# EAGLE design AVRI2CIO_V0_3_LEVEL1 (EAGLE 6.6.0)
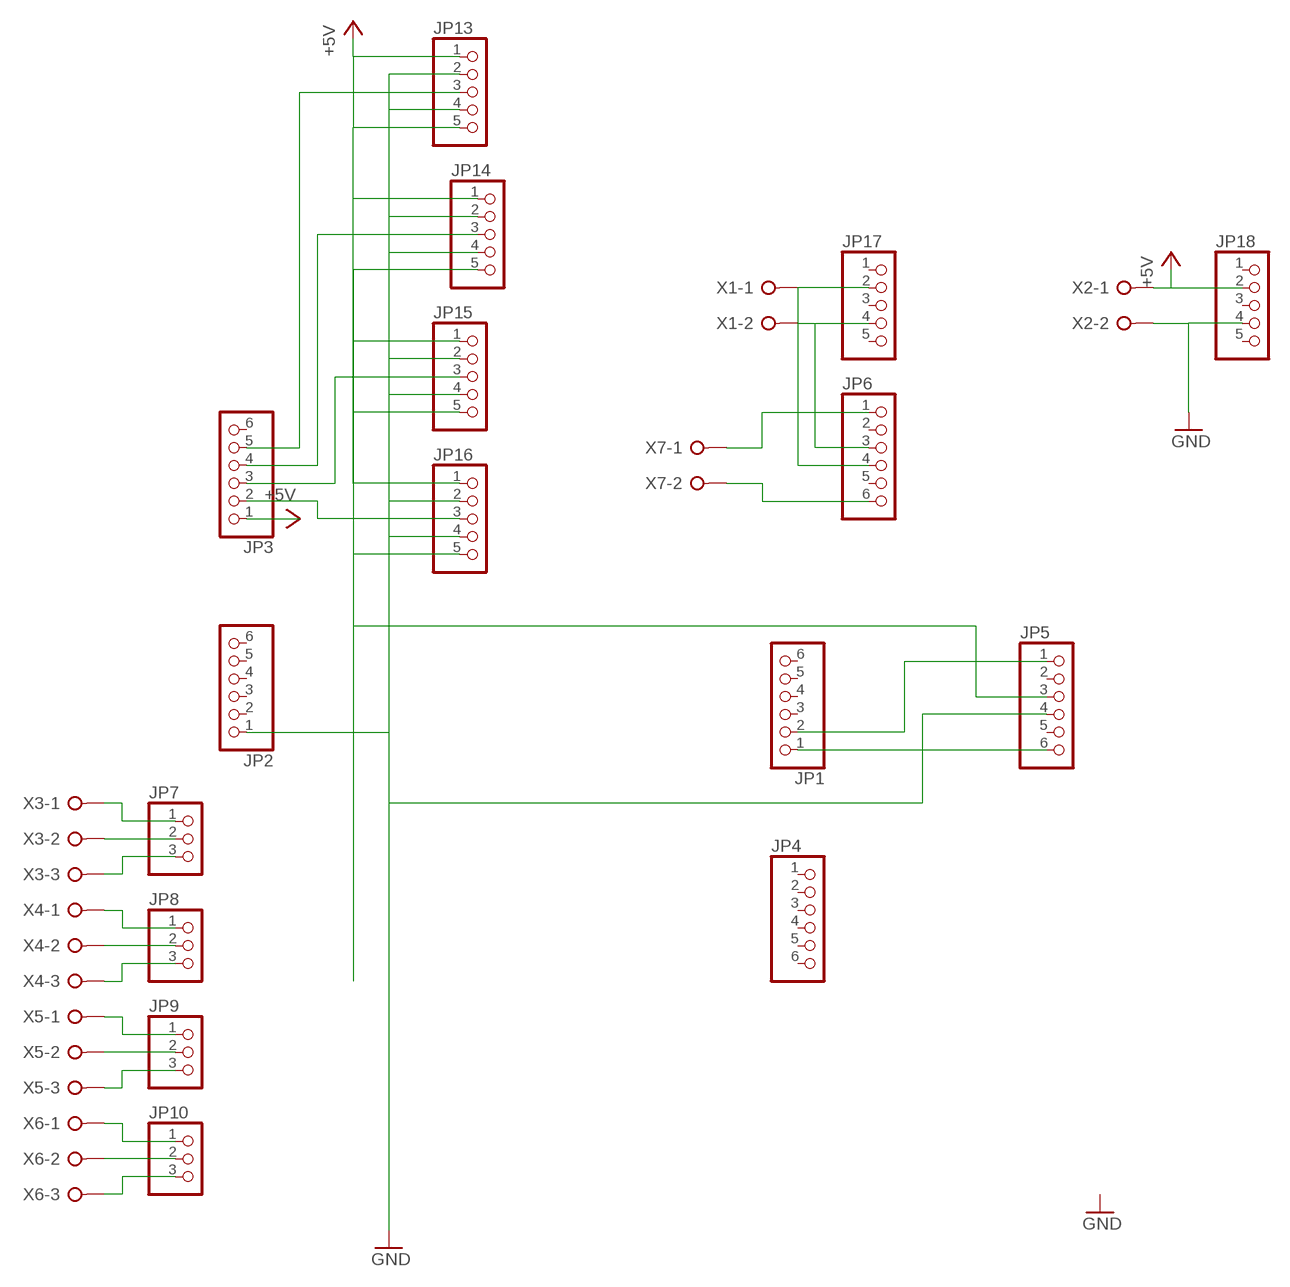
[diagram p0: schematic, sheet 1]

## Parts
JP1  PINHD-1X6  [1X06]
JP2  PINHD-1X6  [1X06]
JP3  PINHD-1X6  [1X06]
JP4  PINHD-1X6  [1X06]
JP5  PINHD-1X6  [1X06]
JP6  PINHD-1X6  [1X06]
JP7  PINHD-1X3  [1X03]
JP8  PINHD-1X3  [1X03]
JP9  PINHD-1X3  [1X03]
JP10  PINHD-1X3  [1X03]
JP13  PINHD-1X5  [1X05]
JP14  PINHD-1X5  [1X05]
JP15  PINHD-1X5  [1X05]
JP16  PINHD-1X5  [1X05]
JP17  PINHD-1X5  [1X05]
JP18  PINHD-1X5  [1X05]
X1  W237-02P  [W237-132]
X2  W237-02P  [W237-132]
X3  W237-3E  [W237-3E]
X4  W237-3E  [W237-3E]
X5  W237-3E  [W237-3E]
X6  W237-3E  [W237-3E]
X7  W237-02P  [W237-132]

## Nets
+5V: JP3.1 JP5.3 JP13.1 JP13.5 JP14.1 JP14.5 JP15.1 JP15.5 JP16.1 JP16.5 JP18.2 X2.1
GND: JP2.1 JP5.4 JP13.2 JP13.4 JP14.2 JP14.4 JP15.2 JP15.4 JP16.2 JP16.4 JP18.4 X2.2
N$1: JP3.3 JP15.3
N$2: JP3.4 JP14.3
N$3: JP3.5 JP13.3
N$11: JP3.2 JP16.3
N$13: JP10.2 X6.2
N$14: JP10.1 X6.1
N$15: JP10.3 X6.3
N$16: JP9.3 X5.3
N$17: JP9.2 X5.2
N$18: JP9.1 X5.1
N$19: JP8.3 X4.3
N$20: JP8.2 X4.2
N$21: JP8.1 X4.1
N$22: JP7.3 X3.3
N$23: JP7.2 X3.2
N$24: JP7.1 X3.1
N$35: JP1.2 JP5.1
N$36: JP1.1 JP5.6
N$37: JP6.4 JP17.2 X1.1
N$40: JP6.3 JP17.4 X1.2
N$42: JP6.1 X7.1
N$43: JP6.6 X7.2
Unconnected: JP1.3 JP1.4 JP1.5 JP1.6 JP2.2 JP2.3 JP2.4 JP2.5 JP2.6 JP3.6 JP4.1 JP4.2 JP4.3 JP4.4 JP4.5 JP4.6 JP5.2 JP5.5 JP6.2 JP6.5 JP17.1 JP17.3 JP17.5 JP18.1 JP18.3 JP18.5

## Library data of the parts
JP1-JP6 = pinhead:PINHD-1X6: PIN HEADER
JP7-JP10 = pinhead:PINHD-1X3: PIN HEADER
JP13-JP18 = pinhead:PINHD-1X5: PIN HEADER
X1 X2 X7 = con-wago-508:W237-02P: WAGO SREW CLAMP; OC_FARNELL: unknown; OC_NEWARK: unknown
X3-X6 = con-wago-508:W237-3E: WAGO SREW CLAMP; OC_FARNELL: unknown; OC_NEWARK: unknown

## Board
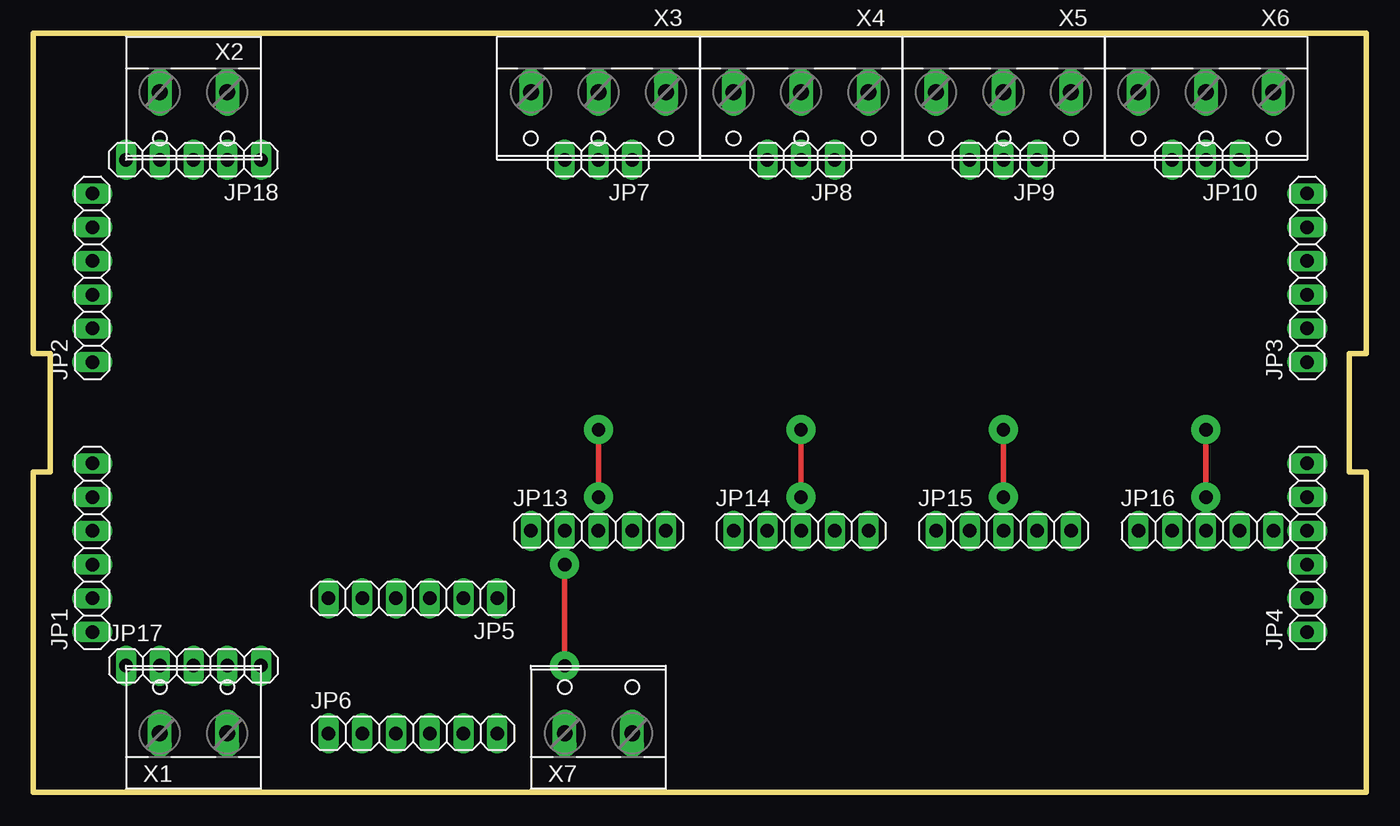
[diagram p1: board, top side]
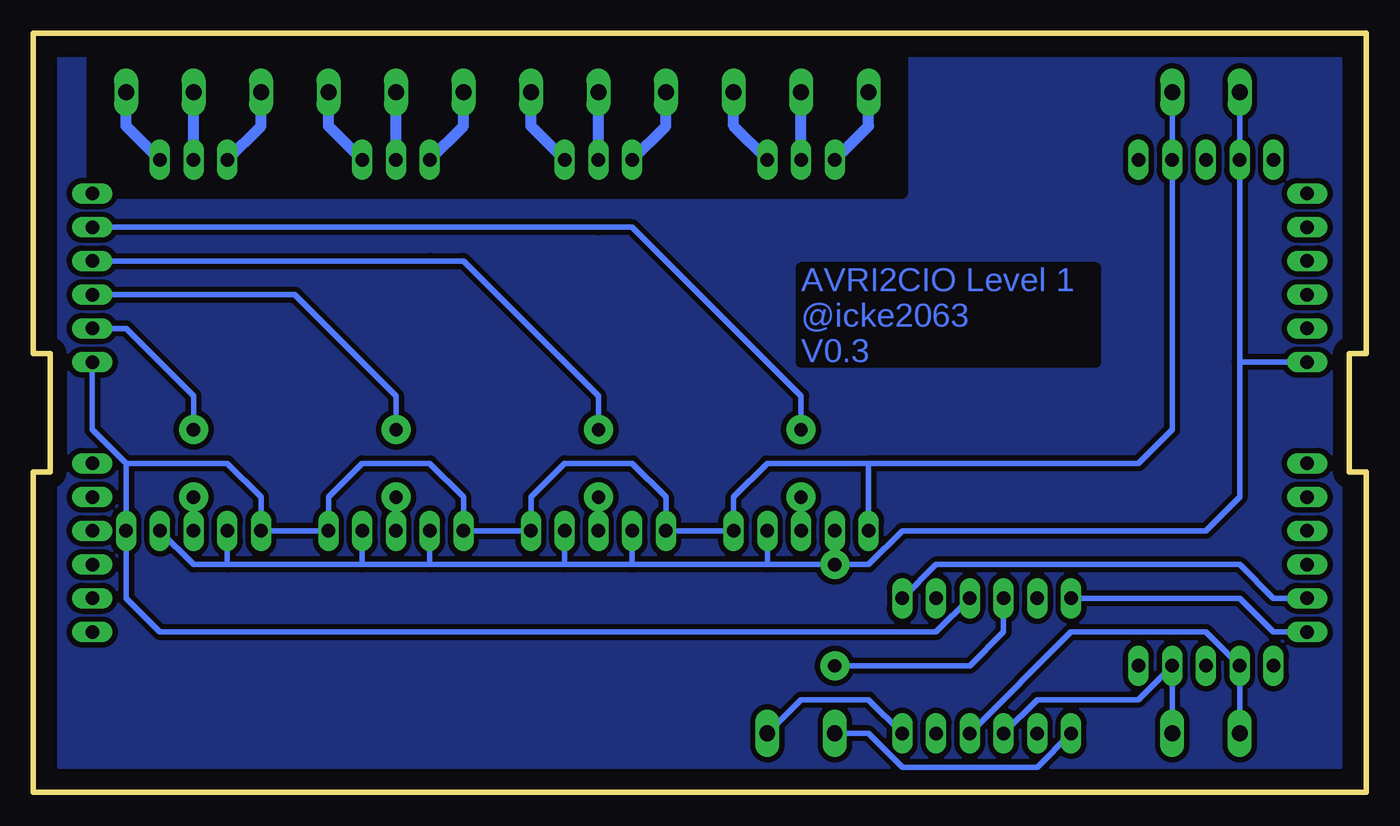
[diagram p2: board, bottom side, seen from below]

Size 100.33 x 57.15 mm. Coordinates in mm from the lower left corner, seen from the top.
Outline: 0,57.15 0,33.02 1.27,33.02 1.27,24.13 0,24.13 0,0 100.33,0 100.33,24.13 99.06,24.13 99.06,33.02 100.33,33.02 100.33,57.15 0,57.15
Copper layers (1*16): Top 0.035mm / dielectric 1.5mm / Bottom 0.035mm
Design rules "default": minimum track width 10mil, minimum drill 24mil, track to track 8mil, track to pad 8mil, pad to pad 8mil, via to via 8mil, smd to smd 8mil, copper to edge 40mil, drill to drill 8mil, minimum pad ring 10mil, minimum via ring 8mil, stop-mask expansion 4mil, vias tented up to drill 0mil, thermal gap 10mil
bRestrict: area 34.9,45.1 to 50.2,57.8; area 50.2,45.1 to 65.4,57.8; area 65.4,45.1 to 80.6,57.8; area 80.6,45.1 to 95.9,57.8

### Footprints (pad centres in the part's own frame; a part is rotated, then mirrored left to right if it is on the bottom)
1X06 = drill 1.016 long: 1 -6.35,0; 2 -3.81,0; 3 -1.27,0; 4 1.27,0; 5 3.81,0; 6 6.35,0
1X03 = drill 1.016 long: 1 -2.54,0; 2 0,0; 3 2.54,0
1X05 = drill 1.016 long: 1 -5.08,0; 2 -2.54,0; 3 0,0; 4 2.54,0; 5 5.08,0
W237-132 = drill 1.194 long: 1 -2.54,-0.635; 2 2.54,-0.635
W237-3E = drill 1.194 long: 1 -5.08,-0.635; 2 0,-0.635; 3 5.08,-0.635

### Placement (x,y rotation side)
JP1  4.45,18.41 90 top
JP2  4.45,38.73 90 top
JP3  95.88,38.73 90 top
JP4  95.88,18.41 90 top
JP5  28.57,14.61 180 top
JP6  28.57,4.45 0 top
JP7  42.55,47.62 180 top
JP8  57.79,47.62 180 top
JP9  73.02,47.62 180 top
JP10  88.27,47.62 180 top
JP13  42.55,19.69 0 top
JP14  57.79,19.69 0 top
JP15  73.02,19.69 0 top
JP16  88.27,19.69 0 top
JP17  12.06,9.52 0 top
JP18  12.06,47.62 180 top
X1  12.06,5.08 0 top
X2  12.06,52.07 180 top
X3  42.55,52.07 180 top
X4  57.79,52.07 180 top
X5  73.02,52.07 180 top
X6  88.27,52.07 180 top
X7  42.55,5.08 0 top

### Tracks (layer width: path | path; a pad name or v marks a point on that pad's centre or on a via)
+5V
  Bottom 0.406: JP3.1 95.88,27.3 93.34,24.77 | 37.47,24.77 45.09,24.77 47.62,22.23 JP13.5 JP14.1 52.71,22.23 55.25,24.77 60.33,24.77 62.87,22.23 JP14.5 JP15.1 67.94,22.23 70.48,24.77 75.56,24.77 78.1,22.23 JP15.5 JP16.1 83.18,22.23 85.72,24.77 93.34,24.77 | 37.47,24.77 JP13.1 | JP5.3 32.39,12.06 90.8,12.06 93.34,14.61 JP16.5 93.34,24.77 | 37.47,24.77 17.14,24.77 14.61,27.3 JP18.2 X2.1
GND  (via drill 1 pad 2.18)
  Top 0.406: v40.01,9.52 v40.01,17.14
  Bottom 0.406: JP2.1 9.53,32.38 | 9.53,32.38 9.53,22.23 12.06,19.69 34.93,19.69 37.47,17.14 v40.01,17.14 | JP13.2 v40.01,17.14 | v40.01,17.14 45.09,17.14 | JP13.4 45.09,17.14 | 45.09,17.14 55.25,17.14 | 55.25,17.14 60.33,17.14 | JP14.2 55.25,17.14 | JP14.4 60.33,17.14 | 60.33,17.14 70.48,17.14 | JP15.2 70.48,17.14 | 70.48,17.14 75.56,17.14 | JP15.4 75.56,17.14 | 75.56,17.14 85.72,17.14 | JP16.2 85.72,17.14 | 85.72,17.14 88.27,17.14 JP16.4 | X2.2 JP18.4 9.53,32.38 | JP5.4 27.3,12.06 29.84,9.52 v40.01,9.52
N$1  (via drill 1 pad 2.18)
  Top 0.406: v73.02,22.23 v73.02,27.3
  Bottom 0.406: JP3.3 83.18,37.46 80.64,37.46 73.02,29.84 v73.02,27.3 | JP15.3 v73.02,22.23
N$2  (via drill 1 pad 2.18)
  Top 0.406: v57.79,22.23 v57.79,27.3
  Bottom 0.406: JP3.4 70.48,40.01 67.94,40.01 57.79,29.84 v57.79,27.3 | JP14.3 v57.79,22.23
N$3  (via drill 1 pad 2.18)
  Top 0.406: v42.55,22.23 v42.55,27.3
  Bottom 0.406: JP13.3 v42.55,22.23 | v42.55,27.3 42.55,29.84 55.25,42.55 57.79,42.55 JP3.5
N$11  (via drill 1 pad 2.18)
  Top 0.406: v88.27,22.23 v88.27,27.3
  Bottom 0.406: JP16.3 v88.27,22.23 | v88.27,27.3 88.27,29.84 93.34,34.92 JP3.2
N$13
  Bottom 0.813: JP10.2 X6.2
N$14
  Bottom 0.813: JP10.1 93.34,50.16 X6.1
N$15
  Bottom 0.813: JP10.3 83.18,50.16 X6.3
N$16
  Bottom 0.813: JP9.3 67.94,50.16 X5.3
N$17
  Bottom 0.813: JP9.2 X5.2
N$18
  Bottom 0.813: JP9.1 78.1,50.16 X5.1
N$19
  Bottom 0.813: JP8.3 52.71,50.16 X4.3
N$20
  Bottom 0.813: JP8.2 X4.2
N$21
  Bottom 0.813: JP8.1 62.87,50.16 X4.1
N$22
  Bottom 0.813: JP7.3 37.47,50.16 X3.3
N$23
  Bottom 0.813: JP7.2 X3.2
N$24
  Bottom 0.813: JP7.1 47.62,50.16 X3.1
N$35
  Bottom 0.406: JP1.2 6.99,14.61 9.53,17.14 32.39,17.14 JP5.1
N$36
  Bottom 0.406: JP1.1 6.99,12.06 9.53,14.61 JP5.6
N$37
  Bottom 0.406: X1.1 JP17.2 12.06,12.06 22.22,12.06 JP6.4
N$40
  Bottom 0.406: X1.2 JP17.4 17.14,6.98 24.76,6.98 JP6.3
N$41
  pour Bottom (isolate 0.406): 1.91,1.9 1.91,55.24 98.42,55.24 98.42,1.9
N$42
  Bottom 0.406: JP6.1 24.76,1.9 34.93,1.9 37.47,4.45 X7.1
N$43
  Bottom 0.406: JP6.6 37.47,6.98 42.55,6.98 X7.2

### Text on the board
Bottom: AVRI2CIO Level 1 / @icke2063 / V0.3